# Altium schematic sheet Inverter.SchDoc
size A0; SheetNumber: 2; SheetTotal: 5
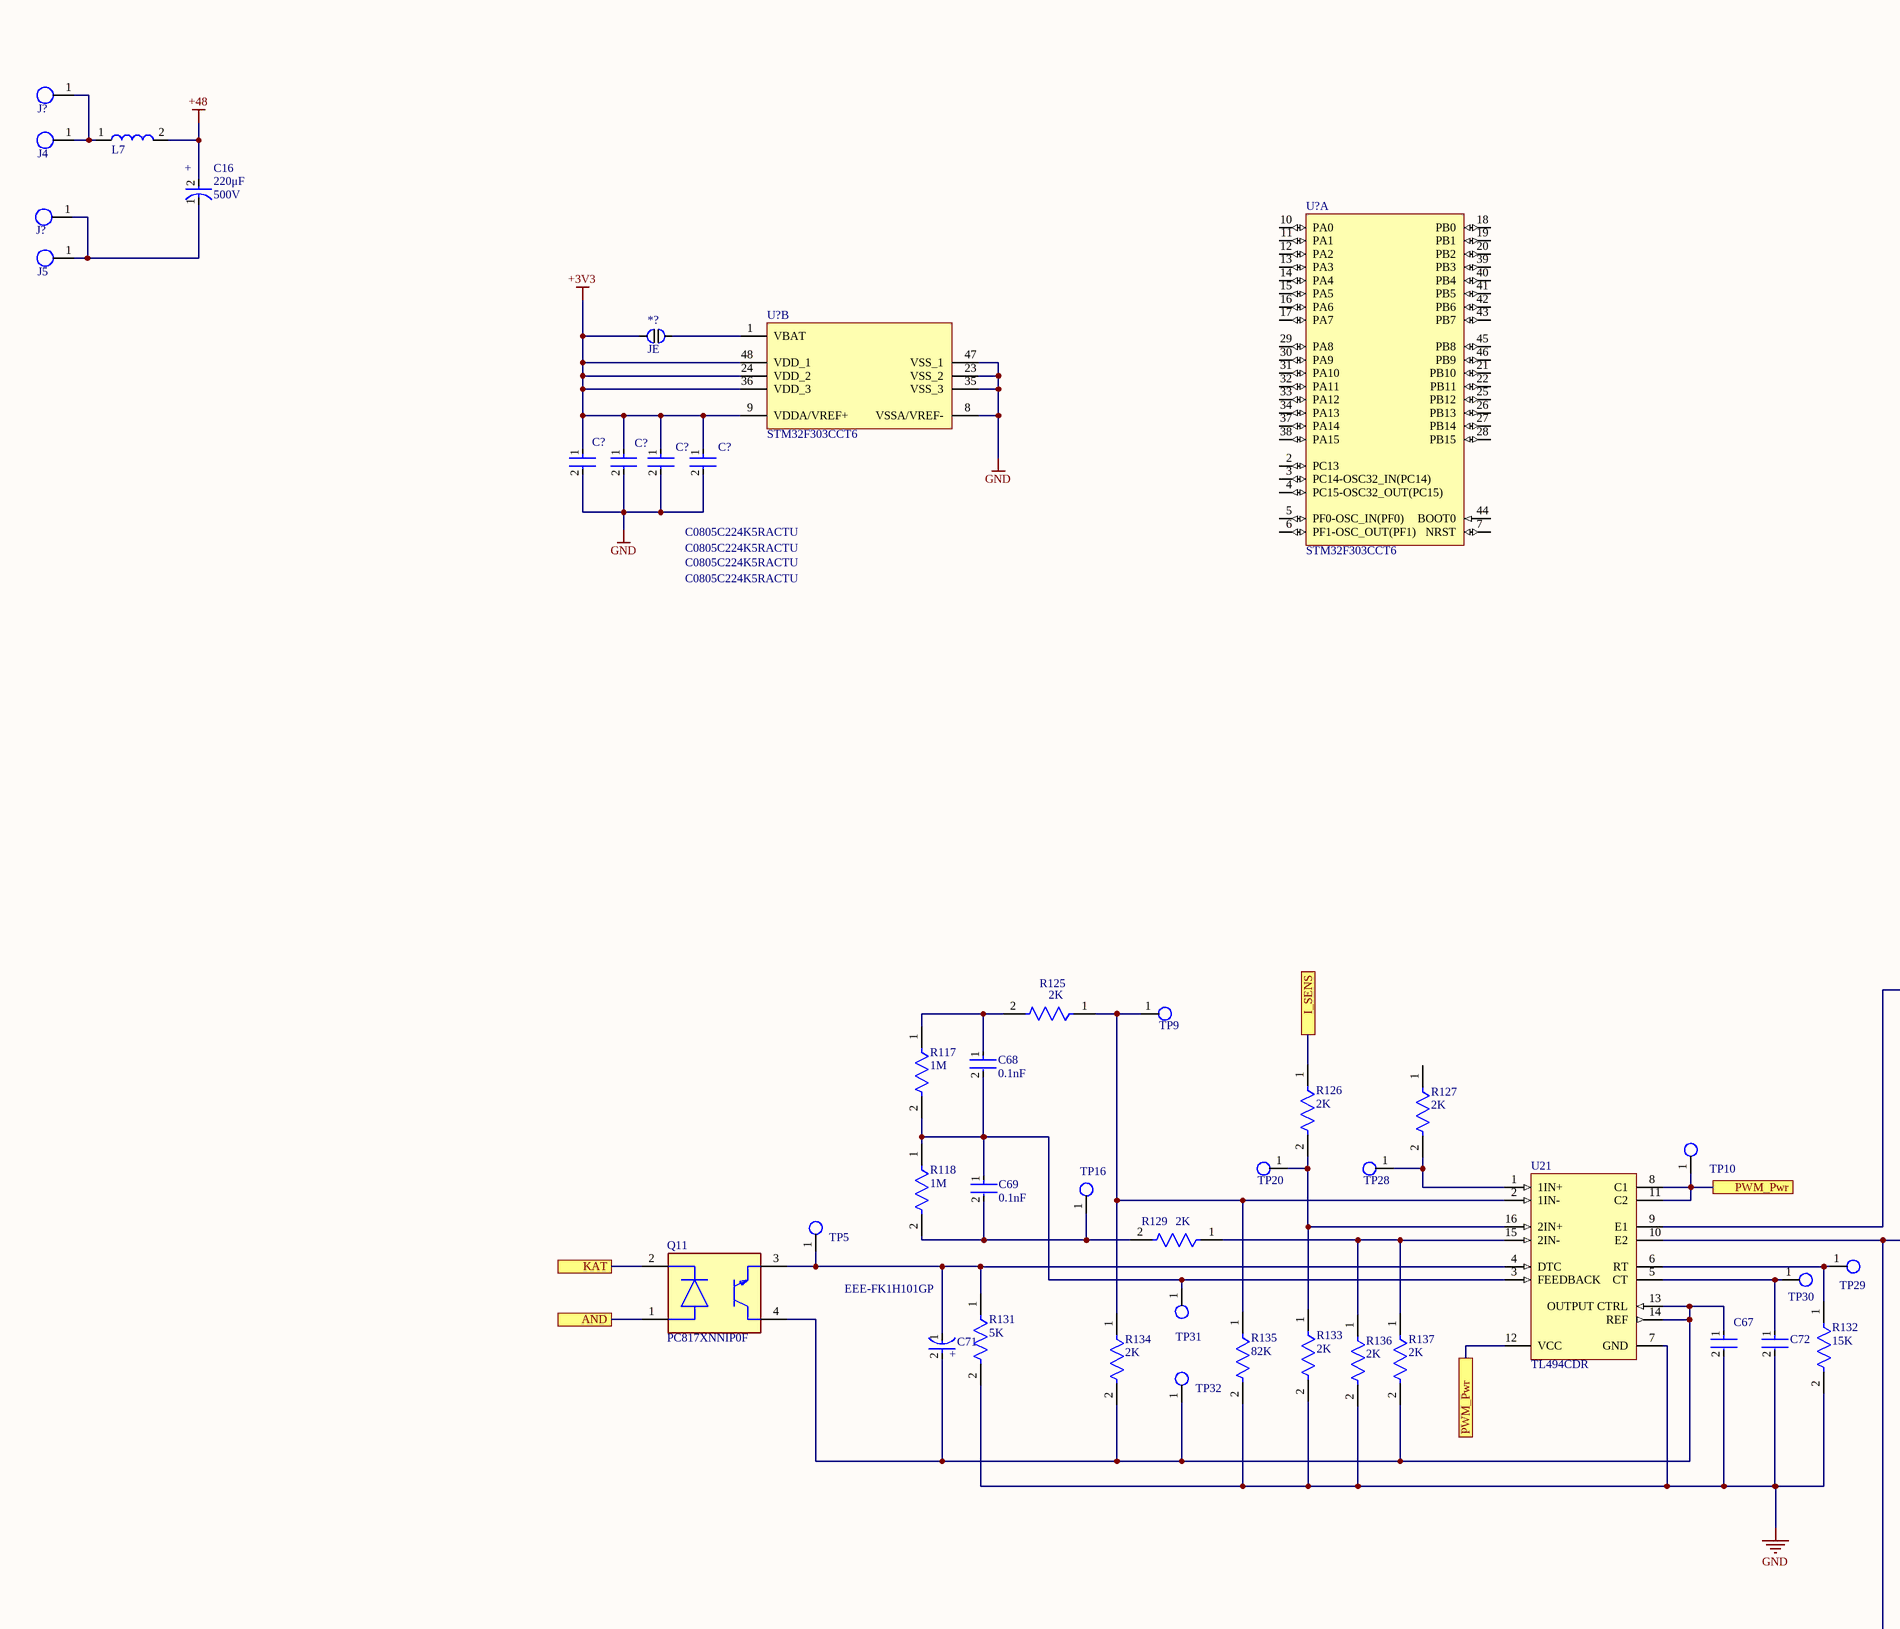
[diagram p0: Inverter.SchDoc, top left]
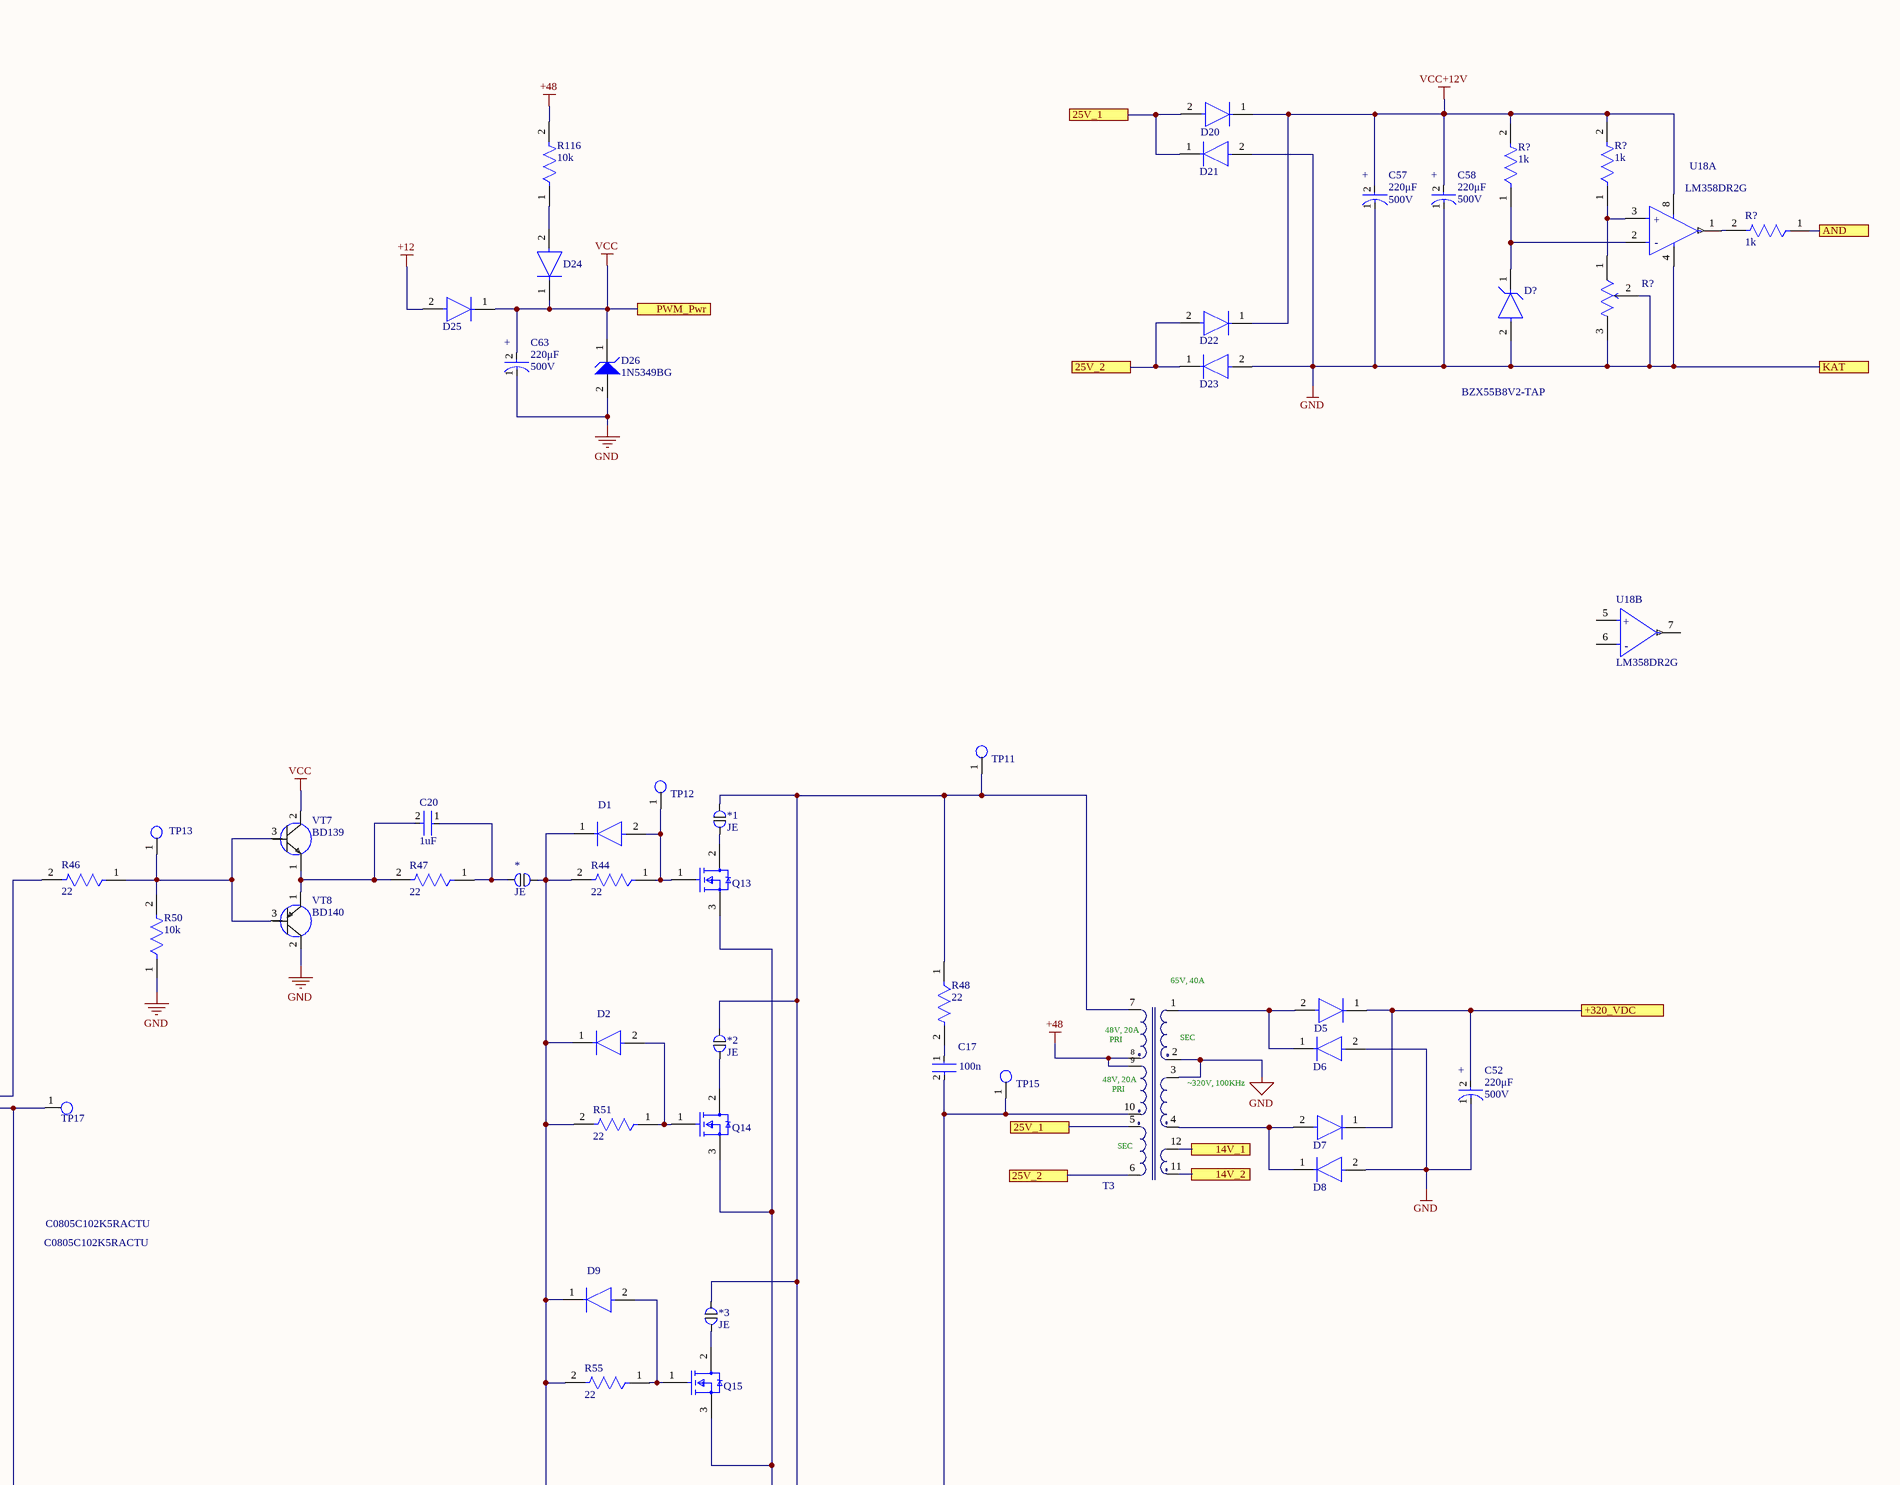
[diagram p1: Inverter.SchDoc, top middle]
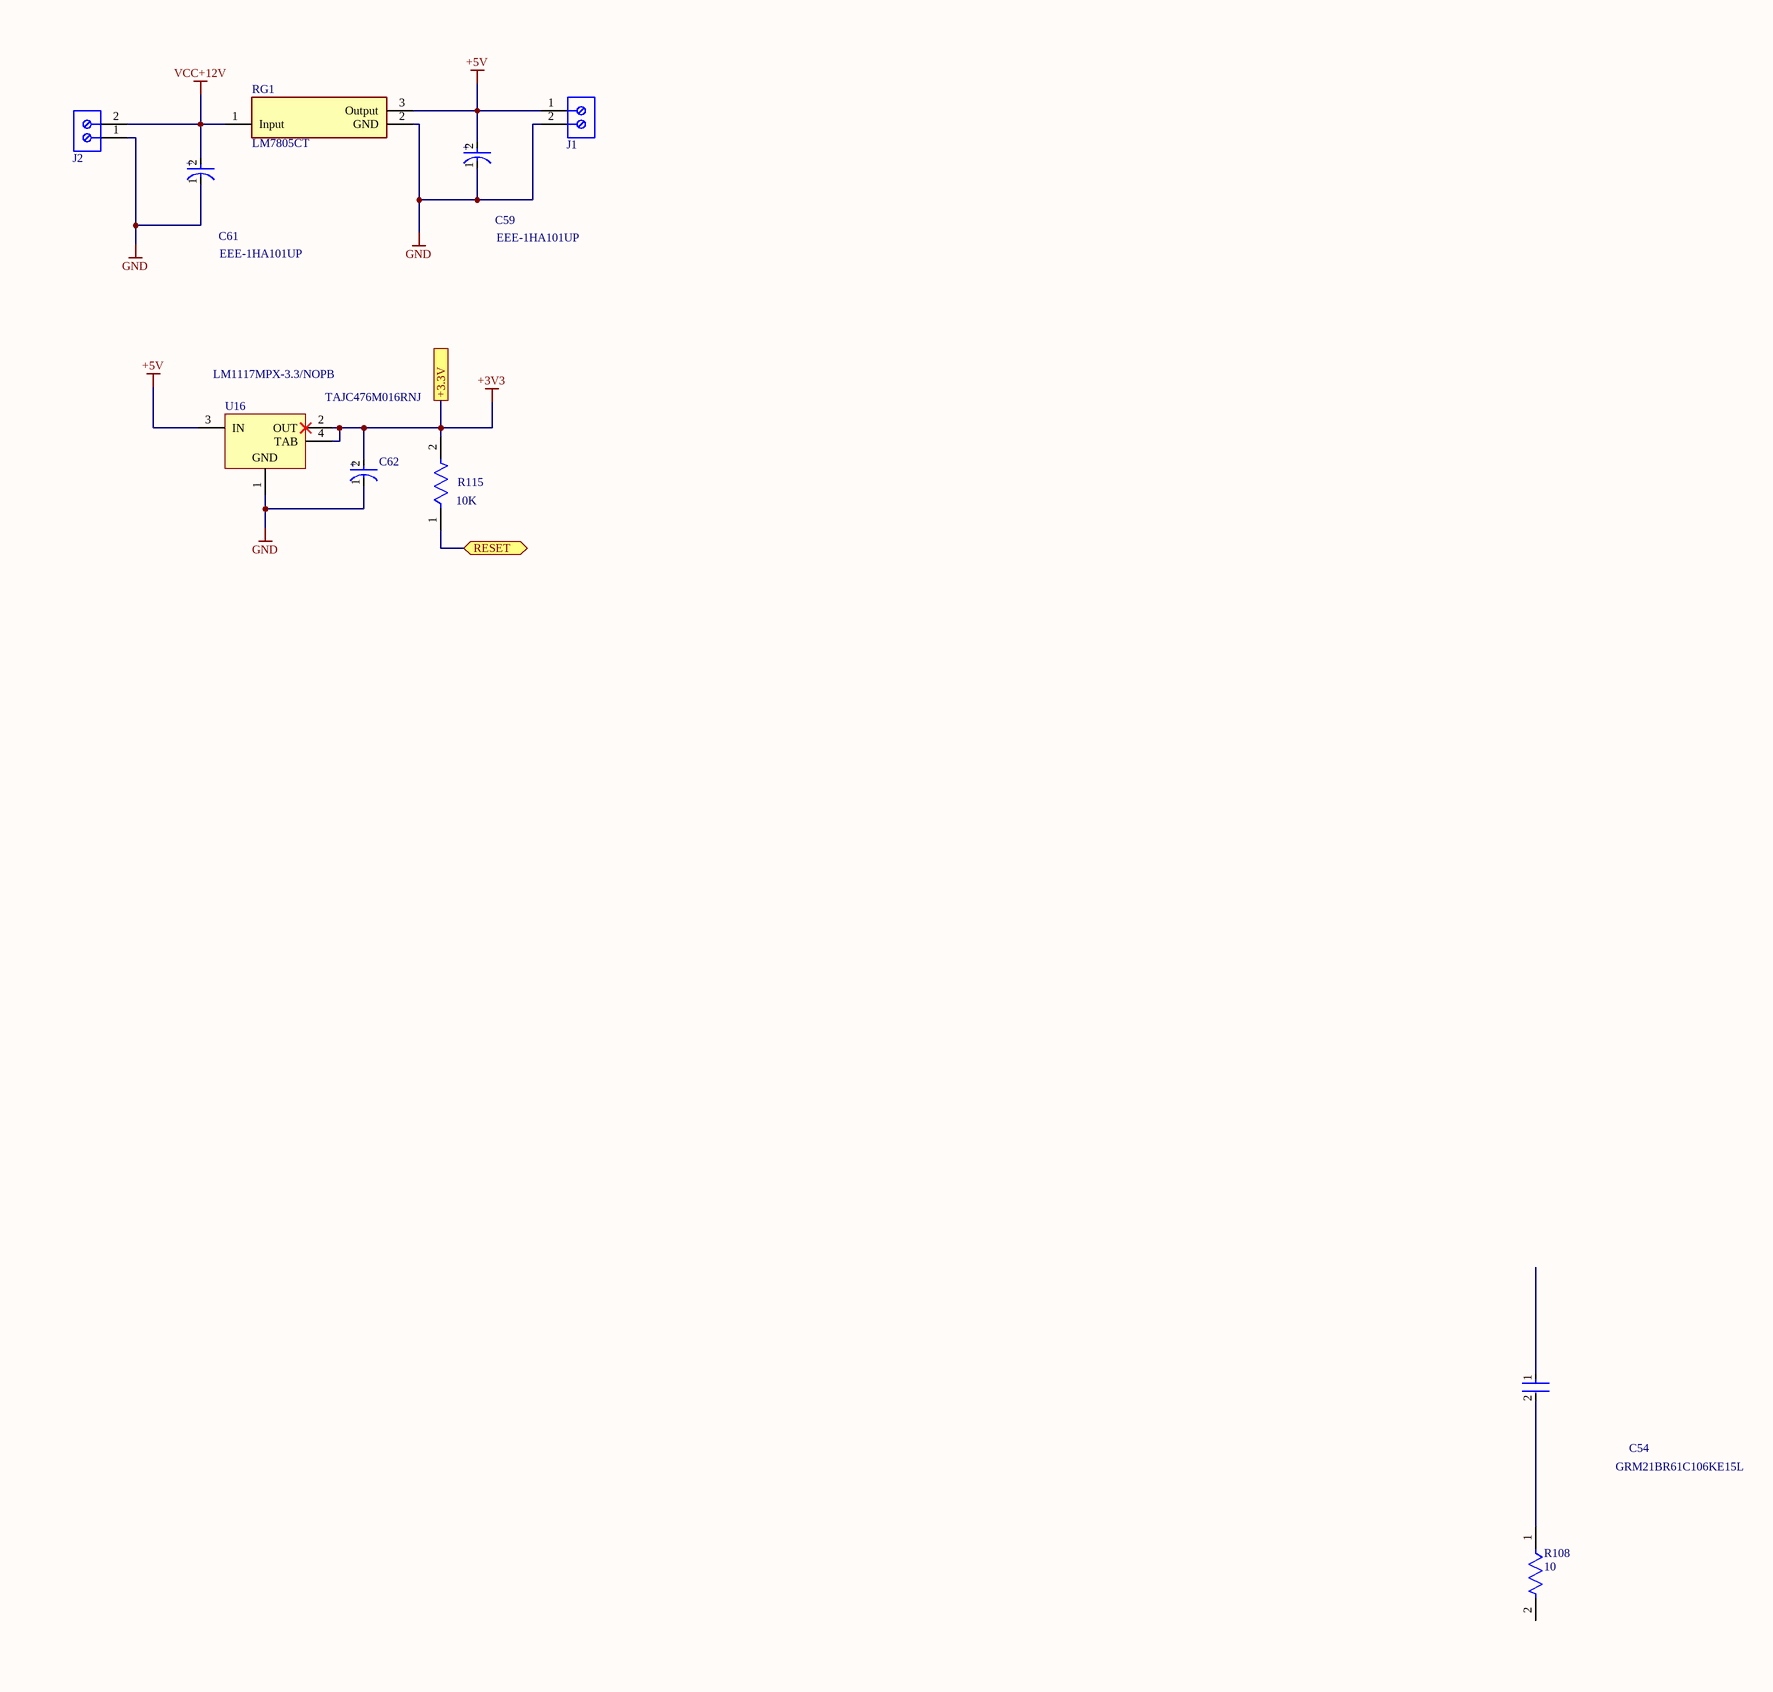
[diagram p2: Inverter.SchDoc, top right]
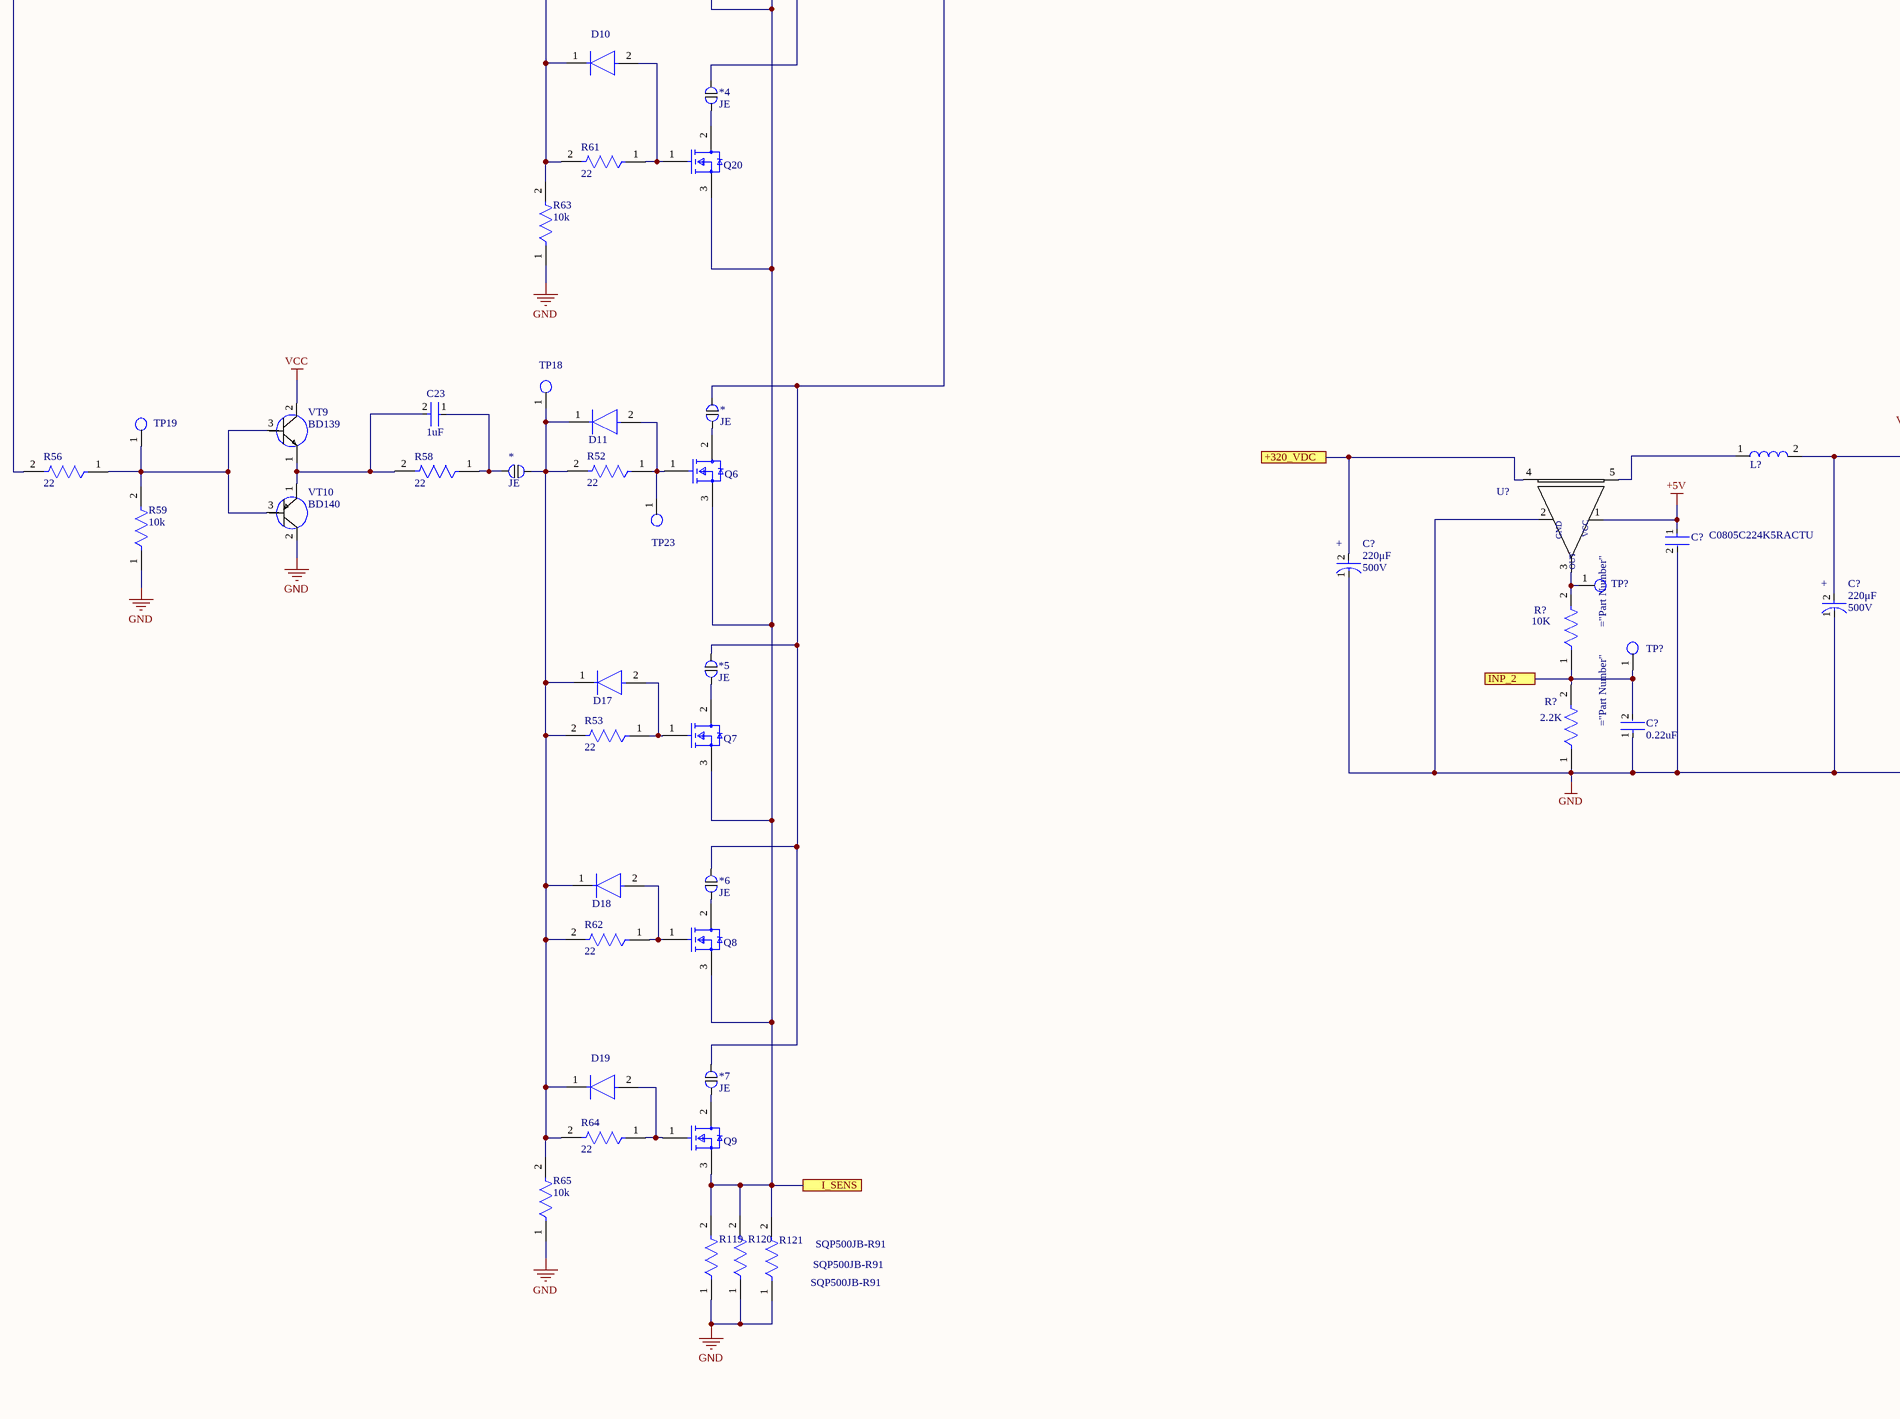
[diagram p3: Inverter.SchDoc, bottom middle]
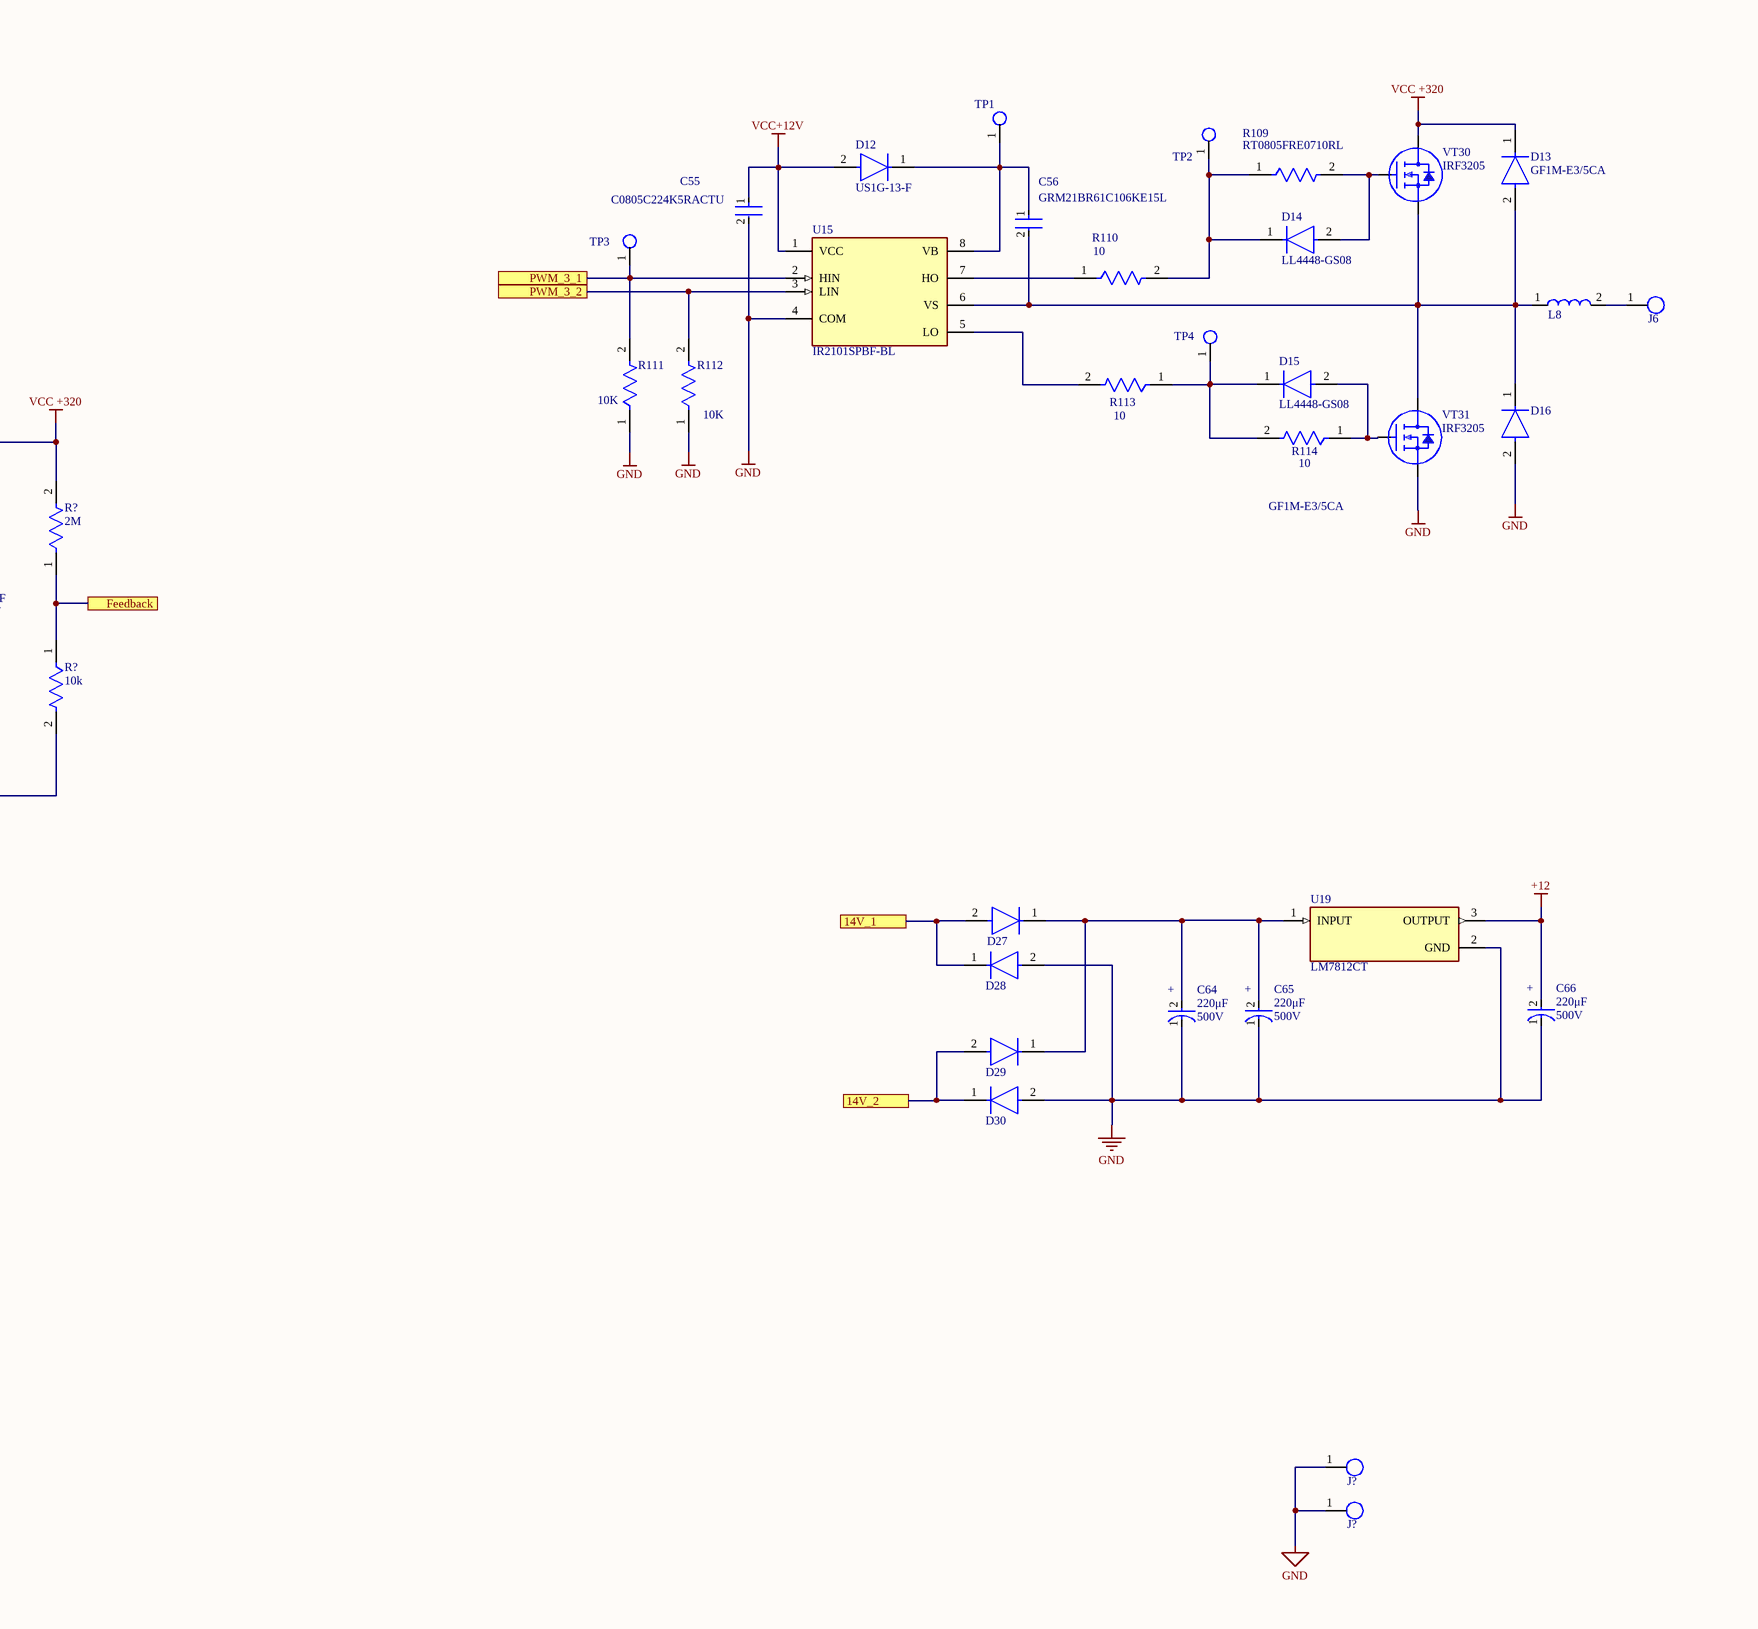
[diagram p4: Inverter.SchDoc, bottom right]

## Parts
(Parts that share a designator on the sheet are numbered #1, #2 ... from top to bottom, then left to right.)
*1  JE  [JE]
*2  JE  [JE]
*3  JE  [JE]
*4  JE  [JE]
*5  JE  [JE]
*6  JE  [JE]
*7  JE  [JE]
*#1  JE  [JE]
*#2  JE  [JE]
*#3  JE  [JE]
*?  JE  [JE]
C16  Capacitance: 220μF  Voltage: 500V  [CAP 330uF 450V]  (hidden comment: Cap_Vishay_MAL219390101E3_eec)
C17  100n  [KEMET_C0805C-DN_IPC_C]
C20  1uF  [KEMET_C0805C-DN_IPC_C]
C23  1uF  [KEMET_C0805C-DN_IPC_C]
C52  Capacitance: 220μF  Voltage: 500V  [CAP 330uF 450V]  (hidden comment: Cap_Vishay_MAL219390101E3_eec)
C54  GRM21BR61C106KE15L  [FP-GRM21B-0_1-IPC_C]
C55  C0805C224K5RACTU  [FP-C0805C-DN-MFG]
C56  GRM21BR61C106KE15L  [FP-GRM21B-0_1-IPC_C]
C57  Capacitance: 220μF  Voltage: 500V  [CAP 330uF 450V]  (hidden comment: Cap_Vishay_MAL219390101E3_eec)
C58  Capacitance: 220μF  Voltage: 500V  [CAP 330uF 450V]  (hidden comment: Cap_Vishay_MAL219390101E3_eec)
C59  EEE-1HA101UP  [FP-SF-MFG]
C61  EEE-1HA101UP  [FP-SF-MFG]
C62  TAJC476M016RNJ  [FP-TAJC-MFG]
C63  Capacitance: 220μF  Voltage: 500V  [CAP 330uF 450V]  (hidden comment: Cap_Vishay_MAL219390101E3_eec)
C64  Capacitance: 220μF  Voltage: 500V  [CAP 330uF 450V]  (hidden comment: Cap_Vishay_MAL219390101E3_eec)
C65  Capacitance: 220μF  Voltage: 500V  [CAP 330uF 450V]  (hidden comment: Cap_Vishay_MAL219390101E3_eec)
C66  Capacitance: 220μF  Voltage: 500V  [CAP 330uF 450V]  (hidden comment: Cap_Vishay_MAL219390101E3_eec)
C67  C0805C102K5RACTU  [FP-C0805C-DN-MFG]
C68  0.1nF  [FP-C0805C-DN-MFG]
C69  0.1nF  [FP-C0805C-DN-MFG]
C71  EEE-FK1H101GP  [FP-FKF-MFG]
C72  C0805C102K5RACTU  [FP-C0805C-DN-MFG]
C?#1  C0805C224K5RACTU  [FP-C0805C-DN-IPC_A]
C?#2  C0805C224K5RACTU  [FP-C0805C-DN-IPC_A]
C?#3  C0805C224K5RACTU  [FP-C0805C-DN-IPC_A]
C?#4  C0805C224K5RACTU  [FP-C0805C-DN-IPC_A]
C?#5  C0805C224K5RACTU  [FP-C0805C-DN-MFG]
C?#6  Capacitance: 220μF  Voltage: 500V  [CAP 330uF 450V]  (hidden comment: Cap_Vishay_MAL219390101E3_eec)
C?#7  Capacitance: 220μF  Voltage: 500V  [CAP 330uF 450V]  (hidden comment: Cap_Vishay_MAL219390101E3_eec)
C?#8  0.22uF  [FP-C0805C-DN-MFG]
D1  Diode_Fairchild-ON_Semiconductor_LL4148_eec  [Fairchild-ON_Semiconductor_LL4148_0]  (value not drawn)
D2  Diode_Fairchild-ON_Semiconductor_LL4148_eec  [Fairchild-ON_Semiconductor_LL4148_0]  (value not drawn)
D5  Diode_Fairchild-ON_Semiconductor_LL4148_eec  [TO-247-2]  (value not drawn)
D6  Diode_Fairchild-ON_Semiconductor_LL4148_eec  [TO-247-2]  (value not drawn)
D7  Diode_Fairchild-ON_Semiconductor_LL4148_eec  [TO-247-2]  (value not drawn)
D8  Diode_Fairchild-ON_Semiconductor_LL4148_eec  [TO-247-2]  (value not drawn)
D9  Diode_Fairchild-ON_Semiconductor_LL4148_eec  [Fairchild-ON_Semiconductor_LL4148_0]  (value not drawn)
D10  Diode_Fairchild-ON_Semiconductor_LL4148_eec  [Fairchild-ON_Semiconductor_LL4148_0]  (value not drawn)
D11  Diode_Fairchild-ON_Semiconductor_LL4148_eec  [Fairchild-ON_Semiconductor_LL4148_0]  (value not drawn)
D12  US1G-13-F  [FP-SMA-MFG]
D13  GF1M-E3/5CA  [FP-GF1M-E3-5CA-MFG]
D14  LL4448-GS08  [FP-6_560-5005_01-4-MFG]
D15  LL4448-GS08  [FP-6_560-5005_01-4-MFG]
D16  GF1M-E3/5CA  [FP-GF1M-E3-5CA-MFG]
D17  Diode_Fairchild-ON_Semiconductor_LL4148_eec  [Fairchild-ON_Semiconductor_LL4148_0]  (value not drawn)
D18  Diode_Fairchild-ON_Semiconductor_LL4148_eec  [Fairchild-ON_Semiconductor_LL4148_0]  (value not drawn)
D19  Diode_Fairchild-ON_Semiconductor_LL4148_eec  [Fairchild-ON_Semiconductor_LL4148_0]  (value not drawn)
D20  Diode_Fairchild-ON_Semiconductor_LL4148_eec  [TO-247-2]  (value not drawn)
D21  Diode_Fairchild-ON_Semiconductor_LL4148_eec  [TO-247-2]  (value not drawn)
D22  Diode_Fairchild-ON_Semiconductor_LL4148_eec  [TO-247-2]  (value not drawn)
D23  Diode_Fairchild-ON_Semiconductor_LL4148_eec  [TO-247-2]  (value not drawn)
D24  Diode_Fairchild-ON_Semiconductor_LL4148_eec  [Fairchild-ON_Semiconductor_LL4148_0]  (value not drawn)
D25  Diode_Fairchild-ON_Semiconductor_LL4148_eec  [Fairchild-ON_Semiconductor_LL4148_0]  (value not drawn)
D26  1N5349BG  [ONSC-SURMETIC40-2-017AA-01]
D27  Diode_Fairchild-ON_Semiconductor_LL4148_eec  [TO-247-2]  (value not drawn)
D28  Diode_Fairchild-ON_Semiconductor_LL4148_eec  [TO-247-2]  (value not drawn)
D29  Diode_Fairchild-ON_Semiconductor_LL4148_eec  [TO-247-2]  (value not drawn)
D30  Diode_Fairchild-ON_Semiconductor_LL4148_eec  [TO-247-2]  (value not drawn)
D?  BZX55B8V2-TAP  [FP-SB-V-3906_04-031_4-MFG]
J1  691101710002  [691101710002]  (value not drawn)
J2  691101710002  [691101710002]  (value not drawn)
J4  KLS8-M3  [KLS8-M3]  (value not drawn)
J5  KLS8-M3  [KLS8-M3]  (value not drawn)
J6  KLS8-M3  [KLS8-M3]  (value not drawn)
J?#1  KLS8-M3  [KLS8-M3]  (value not drawn)
J?#2  KLS8-M3  [KLS8-M3]  (value not drawn)
J?#3  KLS8-M3  [KLS8-M3]  (value not drawn)
J?#4  KLS8-M3  [KLS8-M3]  (value not drawn)
L7  Coil  [Coil_drosel]  (value not drawn)
L8  Coil  [Coil_drosel]  (value not drawn)
L?  Coil  [Coil_drosel]  (value not drawn)
Q6  IRF740PBF  [MOSFET_BEND_rad]  (value not drawn)
Q7  IRF740PBF  [MOSFET_BEND_rad]  (value not drawn)
Q8  IRF740PBF  [MOSFET_BEND_rad]  (value not drawn)
Q9  IRF740PBF  [MOSFET_BEND_rad]  (value not drawn)
Q11  PC817XNNIP0F  [FP-PC817XNNIP0F-MFG]
Q13  IRF740PBF  [Vishay_X15-0364_MFG]  (value not drawn)
Q14  IRF740PBF  [Vishay_X15-0364_MFG]  (value not drawn)
Q15  IRF740PBF  [Vishay_X15-0364_MFG]  (value not drawn)
Q20  IRF740PBF  [Vishay_X15-0364_MFG]  (value not drawn)
R44  22  [Vishay_CRCW0805-e3_IPC_A]
R46  22  [Vishay_CRCW0805-e3_IPC_A]
R47  22  [Vishay_CRCW0805-e3_IPC_A]
R48  22  [Vishay_CRCW0805-e3_IPC_A]
R50  10k  [Vishay_CRCW0805-e3_IPC_A]
R51  22  [Vishay_CRCW0805-e3_IPC_A]
R52  22  [Vishay_CRCW0805-e3_IPC_A]
R53  22  [Vishay_CRCW0805-e3_IPC_A]
R55  22  [Vishay_CRCW0805-e3_IPC_A]
R56  22  [Vishay_CRCW0805-e3_IPC_A]
R58  22  [Vishay_CRCW0805-e3_IPC_A]
R59  10k  [Vishay_CRCW0805-e3_IPC_A]
R61  22  [Vishay_CRCW0805-e3_IPC_A]
R62  22  [Vishay_CRCW0805-e3_IPC_A]
R63  10k  [Vishay_CRCW0805-e3_IPC_A]
R64  22  [Vishay_CRCW0805-e3_IPC_A]
R65  10k  [Vishay_CRCW0805-e3_IPC_A]
R108  10  [FP-CRCW0805-e3-IPC_B]
R109  RT0805FRE0710RL  [FP-RT0805-IPC_C]
R110  10  [FP-RT0805-MFG]
R111  10K  [FP-CRCW0805-e3-IPC_A]
R112  10K  [FP-CRCW0805-e3-IPC_A]
R113  10  [Vishay_CRCW0805-e3_IPC_A]
R114  10  [FP-CRCW0805-e3-IPC_B]
R115  10K  [Vishay_CRCW0805-e3_IPC_A]
R116  10k  [Vishay_CRCW0805-e3_IPC_A]
R117  1M  [FP-CRCW0805-e3-MFG]
R118  1M  [FP-CRCW0805-e3-MFG]
R119  SQP500JB-R91  [FP-SQP500-MFG]
R120  SQP500JB-R91  [FP-SQP500-MFG]
R121  SQP500JB-R91  [FP-SQP500-MFG]
R125  2K  [FP-CRCW0805-e3-MFG]
R126  2K  [FP-CRCW0805-e3-MFG]
R127  2K  [FP-CRCW0805-e3-MFG]
R129  2K  [FP-CRCW0805-e3-MFG]
R131  5K  [FP-CRCW0805-e3-MFG]
R132  15K  [FP-CRCW0805-e3-MFG]
R133  2K  [FP-CRCW0805-e3-MFG]
R134  2K  [FP-CRCW0805-e3-MFG]
R135  82K  [FP-CRCW0805-e3-MFG]
R136  2K  [FP-CRCW0805-e3-MFG]
R137  2K  [FP-CRCW0805-e3-MFG]
R?#1  1k  [Vishay_CRCW0805-e3_IPC_A]
R?#2  1k  [Vishay_CRCW0805-e3_IPC_A]
R?#3  1k  [Vishay_CRCW0805-e3_IPC_A]
R?#4  3296W-1-202LF  [Bourns_3296W_MFG]  (value not drawn)
R?#5  2M  [Vishay_CRCW0805-e3_IPC_A]
R?#6  10K  [Vishay_CRCW0805-e3_IPC_A]
R?#7  10k  [Vishay_CRCW0805-e3_IPC_A]
R?#8  2.2K  [Vishay_CRCW0805-e3_IPC_A]
RG1  Part Number: LM7805CT  [TO-220(bend_rad)]  (hidden comment: Reg_Fairchild_LM7805CT_eec)
T3  ETD59  [ETD-59_3F]  (value not drawn)
TP1  Test_Point_PCB  [Test_Point]  (value not drawn)
TP2  Test_Point_PCB  [Test_Point]  (value not drawn)
TP3  Test_Point_PCB  [Test_Point]  (value not drawn)
TP4  Test_Point_PCB  [Test_Point]  (value not drawn)
TP5  Test_Point_PCB  [Test_Point]  (value not drawn)
TP9  Test_Point_PCB  [Test_Point]  (value not drawn)
TP10  Test_Point_PCB  [Test_Point]  (value not drawn)
TP11  Test_Point_PCB  [Test_Point]  (value not drawn)
TP12  Test_Point_PCB  [Test_Point]  (value not drawn)
TP13  Test_Point_PCB  [Test_Point]  (value not drawn)
TP15  Test_Point_PCB  [Test_Point]  (value not drawn)
TP16  Test_Point_PCB  [Test_Point]  (value not drawn)
TP17  Test_Point_PCB  [Test_Point]  (value not drawn)
TP18  Test_Point_PCB  [Test_Point]  (value not drawn)
TP19  Test_Point_PCB  [Test_Point]  (value not drawn)
TP20  Test_Point_PCB  [Test_Point]  (value not drawn)
TP23  Test_Point_PCB  [Test_Point]  (value not drawn)
TP28  Test_Point_PCB  [Test_Point]  (value not drawn)
TP29  Test_Point_PCB  [Test_Point]  (value not drawn)
TP30  Test_Point_PCB  [Test_Point]  (value not drawn)
TP31  Test_Point_PCB  [Test_Point]  (value not drawn)
TP32  Test_Point_PCB  [Test_Point]  (value not drawn)
TP?#1  Test_Point_PCB  [Test_Point]  (value not drawn)
TP?#2  Test_Point_PCB  [Test_Point]  (value not drawn)
U15  IR2101SPBF-BL  [FP-PG-DSO-8-IPC_B]
U16  LM1117MPX-3.3/NOPB  [DCY0004A_L]
U18  LM358DR2G  [FP-751-07-IPC_C]  (parts A,B of 2)
U19  LM7812CT  [FP-TO220B03-MFG]
U21  TL494CDR  [D0016A_N]
U?#1  STM32F303CCT6  [STM-LQFP48_M]  (part A of 2)
U?#2  STM32F303CCT6  [STM-LQFP48_M]  (part B of 2)
U?#3  ACS758  [ACS758-100]  (value not drawn)
VT7  BD139  [BD139_TO-126_BEND]
VT8  BD140  [BD140_TO-126_BEND]
VT9  BD139  [BD139_TO-126_BEND]
VT10  BD140  [BD140_TO-126_BEND]
VT30  IRF3205  [TO-220(bend2)]
VT31  IRF3205  [TO-220(bend2)]

## Ports
14V_1, 14V_2, 25V_1, 25V_2, +3.3V, +320_VDC, AND, Feedback, I_SENS, INP_2, KAT, PWM_3_1, PWM_3_2, PWM_Pwr, RESET (bidir)

## Nets
+3V3: *?.1 C62.2(A) C?#1.1 C?#2.1 C?#3.1 C?#4.1 R115.2 U16.2(OUT) U16.4(TAB) U?#2.9(VDDA/VREF+) U?#2.24(VDD_2) U?#2.36(VDD_3) U?#2.48(VDD_1) ; port +3.3V
+5V: C59.2(A) C?#5.1 J1.1 RG1.3(Output) U16.3(IN) U?#3.1(+VCC)
+12: C66.2(A) D25.2(A) U19.3(OUTPUT)
+48: C16.2(A) L7.2 R116.2 T3.8 T3.9
GND: C52.1(C) C55.2 C57.1(C) C58.1(C) C59.1(C) C61.1(C) C62.1(C) C63.1(C) C64.1(C) C65.1(C) C66.1(C) C67.2 C72.2 C?#1.2 C?#2.2 C?#3.2 C?#4.2 C?#5.2 C?#6.1(C) C?#7.1(C) C?#8.1 D6.2(A) D8.2(A) D16.2(A) D21.2(A) D23.2(A) D26.2(A) D28.2(A) D30.2(A) D?.2(A) J1.2 J2.1 J?#3.1 J?#4.1 Q11.2(C) R50.1 R59.1 R63.1 R65.1 R111.1 R112.1 R119.1 R120.1 R121.1 R131.2 R132.2 R133.2 R135.2 R136.2 R?#4.2(WIPER) R?#4.3(CW) R?#7.2 R?#8.1 RG1.2(GND) T3.2 T3.3 U15.4(COM) U16.1(GND) U18.4(VEE/GND) U19.2(GND) U21.7(GND) U?#2.8(VSSA/VREF-) U?#2.23(VSS_2) U?#2.35(VSS_3) U?#2.47(VSS_1) U?#3.2(GND) VT8.2(C) VT10.2(C) VT31.S ; port KAT
VCC: C63.2(A) D24.1(C) D25.1(C) D26.1(K) TP10.1(G9) U21.8(C1) U21.11(C2) U21.12(VCC) VT7.2(C) VT9.2(C) ; port PWM_Pwr
VCC +320: C?#7.2(A) D13.1(C) L?.2 R?#5.2 VT30.D
VCC+12V: C55.1 C57.2(A) C58.2(A) C61.2(A) D12.2(A) D20.1(C) D22.1(C) J2.2 R?#1.2 R?#2.2 RG1.1(Input) U15.1(VCC) U18.8(VCC)
14V_1: D27.2(A) D28.1(C) T3.12 ; port 14V_1
14V_2: D29.2(A) D30.1(C) T3.11 ; port 14V_2
25V_1: D20.2(A) D21.1(C) T3.5 ; port 25V_1
25V_2: D22.2(A) D23.1(C) T3.6 ; port 25V_2
+320_VDC: C52.2(A) C?#6.2(A) D5.1(C) D7.1(C) U?#3.4(+IP) ; port +320_VDC
AND: Q11.1(A) R?#3.1 ; port AND
Feedback: R?#5.1 R?#7.1 ; port Feedback
I_SENS: Q6.3(S) Q7.3(S) Q8.3(S) Q9.3(S) Q13.3(S) Q14.3(S) Q15.3(S) Q20.3(S) R119.2 R120.2 R121.2 R126.1 ; port I_SENS
INP_2: C?#8.2 R?#6.1 R?#8.2 TP?#2.1(G9) ; port INP_2
PWM_3_1: R111.2 TP3.1(G9) U15.2(HIN) ; port PWM_3_1
PWM_3_2: R112.2 U15.3(LIN) ; port PWM_3_2
RESET: R115.1 ; port RESET
Net*1_1: *1.1 *2.1 *3.1 *4.1 R48.1 T3.7 TP11.1(G9)
Net*1_2: *1.2 Q13.2(D)
Net*2_2: *2.2 Q14.2(D)
Net*3_2: *3.2 Q15.2(D)
Net*4_2: *4.2 Q20.2(D)
Net*5_1: *5.1 *6.1 *7.1 *#2.1 C17.2 T3.10 TP15.1(G9)
Net*5_2: *5.2 Q7.2(D)
Net*6_2: *6.2 Q8.2(D)
Net*7_2: *7.2 Q9.2(D)
Net*#1_1: *#1.1 D1.1(C) D2.1(C) D9.1(C) D10.1(C) R44.2 R51.2 R55.2 R61.2 R63.2
Net*#1_2: *#1.2 C20.1 R47.1
Net*#2_2: *#2.2 Q6.2(D)
Net*#3_1: *#3.1 D11.1(C) D17.1(C) D18.1(C) D19.1(C) R52.2 R53.2 R62.2 R64.2 R65.2 TP18.1(G9)
Net*#3_2: *#3.2 C23.1 R58.1
Net*?_2: *?.2 U?#2.1(VBAT)
NetC16_1: C16.1(C) J5.1 J?#2.1
NetC17_1: C17.1 R48.2
NetC20_2: C20.2 R47.2 VT7.1(E) VT8.1(E)
NetC23_2: C23.2 R58.2 VT9.1(E) VT10.1(E)
NetC54_2: C54.2 R108.1
NetC56_1: C56.1 D12.1(C) TP1.1(G9) U15.8(VB)
NetC56_2: C56.2 D13.2(A) D16.1(C) L8.1 U15.6(VS) VT30.S VT31.D
NetC64_2: C64.2(A) C65.2(A) D27.1(C) D29.1(C) U19.1(INPUT)
NetC67_1: C67.1 C71.2(A) Q11.4(C) R134.2 R137.2 TP32.1(G9) U21.13(OUTPUT_CTRL) U21.14(REF)
NetC68_1: C68.1 R117.1 R125.2
NetC68_2: C68.2 C69.1 R117.2 R118.1 TP31.1(G9) U21.3(FEEDBACK)
NetC69_2: C69.2 R118.2 R129.2 TP16.1(G9)
NetC71_1: C71.1(C) Q11.3(E) R131.1 TP5.1(G9) U21.4(DTC)
NetC72_1: C72.1 TP30.1(G9) U21.5(CT)
NetD1_2: D1.2(A) Q13.1(G) R44.1 TP12.1(G9)
NetD2_2: D2.2(A) Q14.1(G) R51.1
NetD5_2: D5.2(A) D6.1(C) T3.1
NetD7_2: D7.2(A) D8.1(C) T3.4
NetD9_2: D9.2(A) Q15.1(G) R55.1
NetD10_2: D10.2(A) Q20.1(G) R61.1
NetD11_2: D11.2(A) Q6.1(G) R52.1 TP23.1(G9)
NetD14_1: D14.1(C) R109.1 R110.2 TP2.1(G9)
NetD14_2: D14.2(A) R109.2 VT30.G
NetD15_1: D15.1(C) R113.1 R114.2 TP4.1(G9)
NetD15_2: D15.2(A) R114.1 VT31.G
NetD17_2: D17.2(A) Q7.1(G) R53.1
NetD18_2: D18.2(A) Q8.1(G) R62.1
NetD19_2: D19.2(A) Q9.1(G) R64.1
NetD24_2: D24.2(A) R116.1
NetD?_1: D?.1(C) R?#2.1 U18.2(INPUT_A-)
NetJ4_1: J4.1 J?#1.1 L7.1
NetJ6_1: J6.1 L8.2
NetL?_1: L?.1 U?#3.5(-IP)
NetR46_1: R46.1 R50.2 TP13.1(G9) VT7.3(B) VT8.3(B)
NetR46_2: R46.2 U21.9(E1)
NetR56_1: R56.1 R59.2 TP19.1(G9) VT9.3(B) VT10.3(B)
NetR56_2: R56.2 TP17.1(G9) U21.10(E2)
NetR110_1: R110.1 U15.7(HO)
NetR113_2: R113.2 U15.5(LO)
NetR125_1: R125.1 R134.1 R135.1 TP9.1(G9) U21.2(1IN-)
NetR126_2: R126.2 R133.1 TP20.1(G9) U21.16(2IN+)
NetR127_2: R127.2 TP28.1(G9) U21.1(1IN+)
NetR129_1: R129.1 R136.1 R137.1 U21.15(2IN-)
NetR132_1: R132.1 TP29.1(G9) U21.6(RT)
NetR?#1_1: R?#1.1 R?#4.1(CCW) U18.3(INPUT_A+)
NetR?#3_2: R?#3.2 U18.1(OUTPUT_A)
NetR?#6_2: R?#6.2 TP?#1.1(G9) U?#3.3(OUT)

Not connected (* = marked no-connect by the designer): C54 1; R108 2; R127 1; U18 5(INPUT_B+) 6(INPUT_B-) 7(OUTPUT_B); U?#1 2(PC13) 3(PC14-OSC32_IN(PC14)) 4(PC15-OSC32_OUT(PC15)) 5(PF0-OSC_IN(PF0)) 6(PF1-OSC_OUT(PF1)) 7(NRST) 10(PA0) 11(PA1) 12(PA2) 13(PA3) 14(PA4) 15(PA5) 16(PA6) 17(PA7) 18(PB0) 19(PB1) 20(PB2) 21(PB10) 22(PB11) 25(PB12) 26(PB13) 27(PB14) 28(PB15) 29(PA8) 30(PA9) 31(PA10) 32(PA11) 33(PA12) 34(PA13) 37(PA14) 38(PA15) 39(PB3) 40(PB4) 41(PB5) 42(PB6) 43(PB7) 44(BOOT0) 45(PB8) 46(PB9)

## Notes on the sheet
- (in symbol ACS758) VCC
- (in symbol Cap_Vishay_MAL219390101E3_eec) +
- (in symbol CMP-1310-00291-2, part A) +; -
- (in symbol CMP-1310-00291-2, part B) +; -
- (in symbol CMP-04424-000193-1) +
- (in symbol CMP-05427-000015-1) +
- (in symbol CMP-05427-000032-1) +
- (in symbol Transformer 48x410V) 65V, 40A; 48V, 20A; PRI; SEC; ~320V, 100KHz

## Library data of the parts
C16 C52 C57 C58 C63-C66 C?#6 C?#7 = Cap_Vishay_MAL219390101E3_eec: CAP 220µF 500V Aluminum Capacitors Radial, Can - Snap-In 900 mOhm 6000 Hrs @ 105°C; Manufacturer: Vishay; Tolerance: ±20%; Part Number: MAL219390101E3; helpURL: https://upverter.com/upn/revision/6e31225a6b8864ee/; ComponentLink2Description: Datasheet; Temperature: -25°C to +105°C; Package: RADIAL; Supplier 2: Mouser; Price: 7.89477511745; Supplier 1: Digi-Key; ComponentLink1URL: https://upverter.com/upn/revision/6e31225a6b8864ee/; Supplier Part Number 2: 594-MAL219390101E3; Supplier Part Number 1: 4569PHBK-ND; Value: 220μF; ComponentLink1Description: Upverter; ComponentLink2URL: https://upverter.com/datasheet/b964967ce70ad5180ed35a6206109933e2b1bb55.pdf; RoHS: TRUE; Mouser Part Number: 594-MAL219390101E3; Ipc Land Pattern Name: CAPRD1000W120D3500H3000; Temperature Range High: +105°C; Digikey Description: CAP 220µF 500V Aluminum Capacitors Radial, Can - Snap-In 900 mOhm 6000 Hrs @ 105°C; Digikey Part Number: 4569PHBK-ND; Lead Free: yes; Temperature Range Low: -25°C; Mounting Type: Through Hole
C17 = C0805C104J4RACTU
C20 C23 = C0805C104J4RACTU: 100pF
C54 C56 = CMP-2007-03453-2: Chip Multilayer Ceramic Capacitors for General Purpose, 0805, 10uF, X5R, 15%, 10%, 16V; Radiation Hardening: No; Thickness: 0.053inch; Voltage Rating (DC): 16V; Lead Free: Lead Free; Package Quantity: 1; Width: 1.25mm; Case Code (Imperial): 0805; Depth: 1.25mm; Packaging: Tape and Reel; Dielectric: X5R; Max Operating Temperature: 85°C; Tolerance: 10%; Voltage Rating: 16V; Voltage: 16V; Capacitance: 10uF; Height: 1.25mm; Case Code (Metric): 2012; Material: Ceramic; Mount: Surface Mount; Case/Package: 0805; REACH SVHC: No SVHC; Length: 2mm; Min Operating Temperature: -55°C; Termination: SMD/SMT
C55 C?#1-C?#5 = CMP-1036-04552-2: CAP CER 0.22UF 50V X7R 0805; Manufacturer: KEMET; Value: 0.22 μF; Temperature Coefficient: 30ppm/°C; Material: Ceramic; Tolerance: 0.1; ComponentLink2URL: https://content.kemet.com/datasheets/KEM_C1003_C0G_SMD.pdf; Temperature Characteristic: X7R; Device Class L3: Ceramic Capacitors; Lead Free: Yes; Temperature: -55°C to +125°C; RoHS: TRUE; Capacitance: 0.22 μF; Automotive: No; Octopart: https://octopart.com/c0805c224k5ractu-kemet-144670; Manufacturer Part Number: C0805C224K5RACTU; Temperature Range Low: -55°C; Height: 0.88mm; Device Class L1: Passive Components; Digikey Description: CAP CER 0.22UF 50V X7R 0805; ComponentLink2Description: Datasheet; Mouser Description: CAP CER 0.22UF 50V X7R 0805; Category: Cap; Ipc Land Pattern Name: CAPC200125X78; Temperature Range High: +125°C; Package: C0805C-DN; Device Class L2: Capacitors; Voltage Rating: 50 V
C59 C61 = CMP-05427-000015-1: CAP ALUM 100UF 20% 50V SMD; Manufacturer: Panasonic; Automotive Grade: Grade 3; Leakage Current: 100uA; Dissipation Factor: 0.12%; Life: 2000Hours; Ripple Current: 200mA; Material: Aluminum; ComponentLink2Description: Datasheet; Category: Cap; Voltage Rating: 50V; Value: 100uF; Octopart: https://octopart.com/eee-1ha101up-panasonic-55396734; Digikey Description: CAP ALUM 100UF 20% 50V SMD; Package: SF; RoHS: TRUE; Height: 10.5mm; ComponentLink2URL: https://industrial.panasonic.com/cdbs/www-data/pdf/RDE0000/ABA0000C1145.pdf; Tolerance: 20%; Mouser Description: Cap Aluminum Lytic 100uF 50V 20% (8 X 10.2mm) SMD 200mA 2000h 85C Automotive T/R; Device Class L2: Capacitors; Temperature Range High: +85°C; Lead Free: Yes; Device Class L3: Aluminum Electrolytic Capacitors; Device Class L1: Passive Components; Manufacturer Part Number: EEE-1HA101UP; Temperature: -40°C to +85°C; Automotive: Yes; Capacitance: 100uF; Voltage: 50V; Temperature Range Low: -40°C
C62 = CMP-04424-000193-1: 47uF 16V  ±20% 500mΩ 2312  SMD Tantalum Capacitor; Polarity: Polar; ESR (Equivalent Series Resistance): 500mR; Dissipation Factor: 6%; Leakage Current: 7.5uA; RoHS Compliant: Yes; Case/Package: 6032-28; Construction: Flat; Case Code (Imperial): 2312; Package Quantity: 1; Voltage Rating: 16V; Length: 6mm; Height - Seated (Max): 0.11inch; Voltage Rating (DC): 16V; Series: TAJ; Features: General Purpose; Radiation Hardening: No; Case Code (Metric): 6032; Tolerance: 20%; Max Operating Temperature: 125°C; Depth: 3.2mm; REACH SVHC: No SVHC; Capacitance: 47uF; Width: 3.2mm; Height: 2.8mm; Lead Free: Lead Free; Packaging: Tape and Reel; Number of Pins: 2; Min Operating Temperature: -55°C; Mount: Surface Mount; Termination: SMD/SMT
C67 C72 = CMP-2007-01097-2: CAP CER 1000PF 50V X7R 0805; Manufacturer: KEMET; Capacitance: 1,000 pF; Value: 1,000 pF; Tolerance: 0.1; Temperature Coefficient: 30ppm/°C; Material: Ceramic; Temperature Range High: +125°C; Automotive: No; Device Class L3: Ceramic Capacitors; Category: Cap; Height: 0.88mm; Ipc Land Pattern Name: CAPC200125X78; Mouser Description: Cap Ceramic 0.001uF 50V X7R 10% SMD 0805 125C Plastic T/R; Device Class L1: Passive Components; Lead Free: Yes; Temperature Range Low: -55°C; ComponentLink2URL: https://content.kemet.com/datasheets/KEM_C1003_C0G_SMD.pdf; Octopart: https://octopart.com/c0805c102k5ractu-kemet-93010; Temperature: -55°C to +125°C; Package: C0805C-DN; RoHS: TRUE; Voltage Rating: 50 V; ComponentLink2Description: Datasheet; Digikey Description: CAP CER 1000PF 50V X7R 0805; Device Class L2: Capacitors; Manufacturer Part Number: C0805C102K5RACTU; Temperature Characteristic: X7R
C68 C69 = CMP-2007-00254-2: CAP CER 10000PF 50V X7R 0805; Manufacturer Part Number: C0805C103J5RACTU; Manufacturer: KEMET; Value: 10,000 pF; Material: Ceramic; Temperature Coefficient: 30ppm/°C; Tolerance: 0.05; Device Class L1: Passive Components; Temperature: -55°C to +125°C; Lead Free: Yes; ComponentLink2URL: https://content.kemet.com/datasheets/KEM_C1003_C0G_SMD.pdf; Device Class L3: Ceramic Capacitors; Temperature Characteristic: X7R; Temperature Range High: +125°C; Mouser Description: Capacitor; Ceramic; Cap 0.01uF; Tol 5%; Vol-Rtg 50 V; SMT; Case 0805; X7R; TR; ComponentLink2Description: Datasheet; Height: 0.88mm; Digikey Description: CAP CER 10000PF 50V X7R 0805; Capacitance: 10,000 pF; Temperature Range Low: -55°C; Device Class L2: Capacitors; Octopart: https://octopart.com/c0805c103j5ractu-kemet-133473; Voltage Rating: 50 V; Category: Cap; RoHS: TRUE; Automotive: No; Package: C0805C-DN; Ipc Land Pattern Name: CAPC200125X78
C71 = CMP-05427-000032-1: CAP ALUM 100UF 20% 50V SMD; Ripple Current (AC): 350mA; Impedance: 340mR; Life (Hours): 5000Hour; Leakage Current: 10mA; Voltage: 50V; Voltage Rating (DC): 50V; ESR (Equivalent Series Resistance): 340mR; Packaging: Tape and Reel; Radiation Hardening: No; Construction: Cylindrical; Case/Package: SMD/SMT; Contact Plating: Tin; Min Operating Temperature: -55°C; Lead Free: Lead Free; Mount: Surface Mount; Number of Pins: 2; Height: 10.2mm; Tolerance: 20%; Package Quantity: 1; Voltage Rating: 50V; Termination: SMD/SMT; Width: 10mm; Max Operating Temperature: 105°C; Height - Seated (Max): 0.402inch; RoHS Compliant: Yes; Ripple Current: 350mA; Length: 10.2mm; Capacitance: 100uF; Series: FK; REACH SVHC: No SVHC; Diameter: 8mm
C?#8 = CMP-1036-04552-2: CAP CER 0.22UF 50V X7R 0805; Manufacturer: KEMET; Manufacturer Part Number: C0805C224K5RACTU; Value: 0.22 μF; Temperature Coefficient: 30ppm/°C; Material: Ceramic; Tolerance: 0.1; ComponentLink2URL: https://content.kemet.com/datasheets/KEM_C1003_C0G_SMD.pdf; Temperature Characteristic: X7R; Device Class L3: Ceramic Capacitors; Lead Free: Yes; Temperature: -55°C to +125°C; RoHS: TRUE; Capacitance: 0.22 μF; Automotive: No; Octopart: https://octopart.com/c0805c224k5ractu-kemet-144670; Temperature Range Low: -55°C; Height: 0.88mm; Device Class L1: Passive Components; Digikey Description: CAP CER 0.22UF 50V X7R 0805; ComponentLink2Description: Datasheet; Mouser Description: CAP CER 0.22UF 50V X7R 0805; Category: Cap; Ipc Land Pattern Name: CAPC200125X78; Temperature Range High: +125°C; Package: C0805C-DN; Device Class L2: Capacitors; Voltage Rating: 50 V
D1 D2 D5-D11 D17-D25 D27-D30 = Diode_Fairchild-ON_Semiconductor_LL4148_eec: DIODE GEN PURP 100V 200MA SOD80; Part Number: LL4148; Manufacturer: Fairchild/ON Semiconductor; Num Pins: 2; helpURL: https://upverter.com/upn/revision/7267ed481d20a817/; ComponentLink2Description: Datasheet; Temperature: -55°C to +175°C; Package: SOD80; Supplier 2: Mouser; Price: 0.0408687939508; Supplier 1: Digi-Key; ComponentLink1URL: https://upverter.com/upn/revision/7267ed481d20a817/; Supplier Part Number 2: 512-LL4148; Supplier Part Number 1: LL4148FSCT-ND; ComponentLink1Description: Upverter; ComponentLink2URL: https://www.fairchildsemi.com/datasheets/LL/LL4148.pdf; RoHS: TRUE; Mouser Part Number: 512-LL4148; Temperature Range High: +175°C; Digikey Description: DIODE GEN PURP 100V 200MA SOD80; Digikey Part Number: LL4148FSCT-ND; Lead Free: yes; Temperature Range Low: -55°C
D12 = CMP-12791-000009-1: DIODE GEN PURP 400V 1A SMA; Manufacturer: Diodes Inc.; Max Surge Forward Current: 30A; Peak Reverse Current: 5uA; Standoff Height: 0.05mm; Value: 20pF; Max Junction Temp: +150°C; Digikey Description: DIODE GEN PURP 400V 1A SMA; ComponentLink2URL: https://www.diodes.com/assets/Datasheets/ds16008.pdf; Device Class L1: Discrete Semiconductors; Mouser Description: Rectifiers 400V 1A; Manufacturer Part Number: US1G-13-F; Package: SMA; Height: 2.4mm; Automotive: No; Temperature Range High: +150°C; RoHS: TRUE; Lead Free: Yes; Temperature: -65°C to +150°C; Category: Diode; Octopart: https://octopart.com/us1g-13-f-diodes+inc.-334651; Temperature Range Low: -65°C; Forward Current: 1A; Footprint Url: https://www.diodes.com/assets/Package-Files/SMA.pdf; ComponentLink2Description: Datasheet; Reverse Voltage: 400V; Capacitance: 20pF; Device Class L3: Rectifier Diodes; Max Repetitive Reverse Voltage: 400V; Device Class L2: Diodes
D13 D16 = CMP-02540-000074-1: DIODE GEN PURP 1KV 1A DO214BA; Forward Voltage: 1.2V; Reverse Recovery Time-Max: 2s; Recovery Time: 3000ns; Peak Non-Repetitive Surge Current: 30A; Max Reverse Current: 5uA; Reverse Recovery Time: 2us; Element Configuration: Single; Length: 4.75mm; Height: 2.74mm; Case/Package: DO-214BA; Average Rectified Current: 1A; Packaging: Tape and Reel; Forward Current: 1A; Width: 2.9mm; Package Quantity: 1; Max Repetitive Reverse Voltage (Vrrm): 1kV; Mount: Surface Mount; Radiation Hardening: No; Max Forward Surge Current (Ifsm): 30A; Max Surge Current: 30A; Reverse Voltage: 1kV; Max Operating Temperature: 175°C; RoHS Compliant: Yes; Series: SUPERECTIFIER®; Number of Pins: 2; Min Operating Temperature: -65°C; Lead Free: Lead Free; Max Reverse Voltage (DC): 1kV
D14 D15 = CMP-249167-000001-1: DIODE GEN PURP 75V 150MA SOD80; Manufacturer: Vishay Small Signal; Max Junction Temp: +175°C; Automotive Grade: Grade 0; Capacitance: 4pF; Peak Reverse Current: 5uA; Forward Current: 300mA; Max Repetitive Reverse Voltage: 100V; Max Surge Forward Current: 2A; Value: 4pF; ComponentLink2Description: Datasheet; Height: 1.6mm; ComponentLink2URL: http://www.vishay.com/docs/85557/ll4148.pdf; Category: Diode; Lead Free: Yes; Device Class L3: Rectifier Diodes; Reverse Voltage: 75V; Mouser Description: Diodes - General Purpose, Power, Switching 100 Volt 100mA; RoHS: TRUE; Temperature: to +175°C; Automotive: Yes; Octopart: https://octopart.com/ll4448-gs08-vishay+small+signal-40886; Digikey Description: DIODE GEN PURP 75V 150MA SOD80; Manufacturer Part Number: LL4448-GS08; Temperature Range High: +175°C; Device Class L1: Discrete Semiconductors; Device Class L2: Diodes; Package: 6.560-5005.01-4
D26 = CMP-1060-01280-1: 5 W Zener Voltage Regulator, 2-Pin Surmetic(TM) 40, Pb-Free, Bulk Box; Manufacturer: On Semiconductor; P Max (W): 5; VZ Typ (V): 12; PartNumber: 1N5349BG; ComponentLink1URL: http://www.onsemi.com/; ComponentLink3URL: http://www.onsemi.cn/pub_link/Collateral/017AA.PDF; Mounting Technology: Through Hole; PackageDescription: 2-Pin, Axial Lead, Diameter 3.49 mm; ComponentLink1Description: Manufacturer URL; ComponentLink2URL: http://www.onsemi.cn/pub_link/Collateral/1N5333B-D.PDF; DatasheetVersion: Rev. 14; PackageVersion: Rev. O, 09/2005; ComponentLink3Description: Package Specification; RoHS: Pb-Free; PackageReference: SURMETIC40-2-017AA-01; Packing: Bulk Box; ComponentLink2Description: Datasheet
D? = CMP-02541-000026-1: DIODE ZENER 8.2V 500MW DO35; Test Current: 5mA; Tolerance: 2%; Impedance: 7R; ESD Protection: No; Element Configuration: Single; Max Reverse Leakage Current: 100nA; Packaging: Ammo Pack; Case/Package: DO-35; Lead Free: Lead Free; Number of Pins: 2; Min Operating Temperature: -65°C; Contact Plating: Tin; Max Power Dissipation: 500mW; Radiation Hardening: No; Max Operating Temperature: 175°C; Mount: Through Hole; Package Quantity: 30000; Voltage Tolerance: 2%; Series: Automotive, AEC-Q101; Zener Voltage: 8.2V; RoHS Compliant: Yes; Power Dissipation: 500mW
J1 J2 = 691101710002: WR-TBL Series 101 Horizontal Entry Modular, THT, pitch 5mm, 2p; Manufacturer: Wurth Elektronik; Modularity: Yes; Rated Current: 16A; Working Voltage: 250V; ComponentLink1Description: Website Link; ComponentLink1URL: https://www.we-online.com/redexpert/article/691101710002?ad; ComponentLink2Description: Datasheet Link; ComponentLink2URL: https://www.we-online.com/redexpert/spec/691101710002?ad; Manufacturer Part Number: 691101710002; Category: Terminal Blocks; Match Code: WR-TBL; Mount: Through Hole; Operating Temperature Max: 105°C; Operating Temperature Min: -40°C; Packaging: Box; Application: Pressure Clamp; Number of Pins: 2; Number of Rows: 1; Orientation: Horizontal; Pitch: 5mm
Q11 = CMP-65434-000005-1: OPTOISOLATOR 5KV TRANS 4SMD; Reverse Breakdown Voltage: 6V; Output Current per Channel: 30mA; Power Dissipation: 200mW; Collector-emitter Voltage-Max: 200mV; Max Output Voltage: 80V; Input Current: 50mA; Forward Voltage: 1.4V; Fall Time: 18000ns; Number of Elements: 1; Input Type: DC; Packaging: Tape and Reel; RoHS Compliant: Yes; Contact Plating: Copper; Min Operating Temperature: -30°C; Collector Emitter Saturation Voltage: 200mV; Max Input Current: 50mA; Radiation Hardening: No; Max Collector Current: 50mA; Case/Package: SMD/SMT; Mount: Surface Mount; Output Voltage: 80V; Forward Current: 50mA; Max Power Dissipation: 200mW; Collector Emitter Voltage (VCEO): 80V; Number of Channels: 1; Rise Time: 18000ns; Isolation Voltage: 5kV; Number of Pins: 4; Lead Free: Lead Free; Package Quantity: 2000; Isolation Voltage-Max: 5kV; Max Operating Temperature: 100°C
R44 R46-R48 R50-R53 R55 R56 R58 R59 R61-R65 R108 R113-R116 R?#1-R?#3 R?#7 = CRCW08050000Z0EA
  R44 R46-R48 R50-R53 R55 R56 R58 R59 R61-R65 R108 R113 R114 R116 R?#1-R?#3 R?#7: 100k: *
R109 = CMP-03412-028725-1: RES SMD 10 OHM 1% 1/8W 0805; Manufacturer: Yageo; Tolerance: 0.0001; Value: 10Ω; Temperature Coefficient: 50 ppm/°C; Voltage Rating: 150V; Power Rating: 0.125W; Package: RT0805; Lead Free: Yes; Manufacturer Part Number: RT0805FRE0710RL; Series: RT; Footprint Url: http://www.yageo.com/exep/pages/download/literatures/PYu-R_Mount_10.pdf; Temperature Range High: +155°C; Temperature Range Low: -55°C; Octopart: https://octopart.com/rt0805fre0710rl-yageo-39855890; Height: 0.6mm; Device Class L1: Passive Components; Mouser Description: High Precision-High Stability Chip Resistor Thin Film 0805 10Ohm 1% Paper T/R; ComponentLink2URL: http://www.yageo.com/documents/recent/PYu-RT_1-to-0.01_RoHS_L_9.pdf; Device Class L2: Resistors; Composition: Thin Film; Device Class L3: Chip SMD Resistors; Automotive: No; RoHS: TRUE; Ipc Land Pattern Name: RESC200125X50; Temperature: -55°C to +155°C; ComponentLink2Description: Datasheet; Resistance: 10Ω; Category: Res; Digikey Description: RES SMD 10 OHM 1% 1/8W 0805
R110 = CMP-03412-028725-1: RES SMD 10 OHM 1% 1/8W 0805; Manufacturer Part Number: RT0805FRE0710RL; Manufacturer: Yageo; Tolerance: 0.0001; Value: 10Ω; Temperature Coefficient: 50 ppm/°C; Voltage Rating: 150V; Power Rating: 0.125W; Package: RT0805; Lead Free: Yes; Series: RT; Footprint Url: http://www.yageo.com/exep/pages/download/literatures/PYu-R_Mount_10.pdf; Temperature Range High: +155°C; Temperature Range Low: -55°C; Octopart: https://octopart.com/rt0805fre0710rl-yageo-39855890; Height: 0.6mm; Device Class L1: Passive Components; Mouser Description: High Precision-High Stability Chip Resistor Thin Film 0805 10Ohm 1% Paper T/R; ComponentLink2URL: http://www.yageo.com/documents/recent/PYu-RT_1-to-0.01_RoHS_L_9.pdf; Device Class L2: Resistors; Composition: Thin Film; Device Class L3: Chip SMD Resistors; Automotive: No; RoHS: TRUE; Ipc Land Pattern Name: RESC200125X50; Temperature: -55°C to +155°C; ComponentLink2Description: Datasheet; Resistance: 10Ω; Category: Res; Digikey Description: RES SMD 10 OHM 1% 1/8W 0805
R111 R112 = CMP-2001-04908-2: RES Thick Film, 10kΩ, 1%, 0.125W, 100ppm/°C, 0805; Resistance: 10kR; Voltage Rating (DC): 150V; Power Rating: 125mW; Weight: 0.000194oz; Package Quantity: 5000; Military Standard: Not; Max Operating Temperature: 155°C; Temperature Coefficient: 100ppm/°C; Contact Plating: Tin; Width: 1.25mm; Height: 0.45mm; Radiation Hardening: No; Tolerance: 1%; Min Operating Temperature: -55°C; Voltage Rating: 150V; Length: 2mm; Depth: 1.25mm; Termination: SMD/SMT; Packaging: Tape and Reel; Case/Package: 0805; Case Code (Metric): 2012; Lead Free: Lead Free; Case Code (Imperial): 0805; Composition: Thick Film
R117 R118 = CMP-2001-04908-2: RES Thick Film, 1MΩ, 1%, 0.125W, 100ppm/°C, 0805; Resistance: 10kR; Voltage Rating (DC): 150V; Power Rating: 125mW; Weight: 0.000194oz; Package Quantity: 5000; Military Standard: Not; Max Operating Temperature: 155°C; Temperature Coefficient: 100ppm/°C; Contact Plating: Tin; Width: 1.25mm; Height: 0.45mm; Radiation Hardening: No; Tolerance: 1%; Min Operating Temperature: -55°C; Voltage Rating: 150V; Length: 2mm; Depth: 1.25mm; Termination: SMD/SMT; Packaging: Tape and Reel; Case/Package: 0805; Case Code (Metric): 2012; Lead Free: Lead Free; Case Code (Imperial): 0805; Composition: Thick Film
R119-R121 = CMP-03413-000003-1: RES 1.2 OHM 5W 5% AXIAL; Manufacturer Part Number: SQP500JB-1R2; Manufacturer: Yageo; Temperature Coefficient: 300ppm/°C; Resistance: 1.2Ω; Value: 1.2Ω; Voltage Rating: 350V; Lead Free: Yes; Package: SQP500; Composition: Wirewound; Series: SQP; Temperature: -55°C to +155°C; Device Class L2: Resistors; Digikey Description: RES 1.2 OHM 5W 5% AXIAL; RoHS: TRUE; Device Class L3: Through-Hole Resistors; ComponentLink2Description: Datasheet; ComponentLink2URL: https://datasheet.ciiva.com/2723/yageolr-sqpnsp-2013-2723111.pdf; Temperature Range High: +155°C; Octopart: https://octopart.com/sqp500jb-1r2-yageo-1162571; Device Class L1: Passive Components; Tolerance: 5%; Height: 10mm; Category: Res; Ipc Land Pattern Name: RESAD2911W100L2350D1050; Automotive: No; Power Rating: 5W; Temperature Range Low: -55°C
R125-R127 R129 R133 R134 R136 R137 = CMP-2001-04908-2: RES Thick Film, 2kΩ, 1%, 0.125W, 100ppm/°C, 0805; Resistance: 10kR; Voltage Rating (DC): 150V; Power Rating: 125mW; Weight: 0.000194oz; Package Quantity: 5000; Military Standard: Not; Max Operating Temperature: 155°C; Temperature Coefficient: 100ppm/°C; Contact Plating: Tin; Width: 1.25mm; Height: 0.45mm; Radiation Hardening: No; Tolerance: 1%; Min Operating Temperature: -55°C; Voltage Rating: 150V; Length: 2mm; Depth: 1.25mm; Termination: SMD/SMT; Packaging: Tape and Reel; Case/Package: 0805; Case Code (Metric): 2012; Lead Free: Lead Free; Case Code (Imperial): 0805; Composition: Thick Film
R131 = CMP-2001-04908-2: RES Thick Film, 5kΩ, 1%, 0.125W, 100ppm/°C, 0805; Resistance: 10kR; Voltage Rating (DC): 150V; Power Rating: 125mW; Weight: 0.000194oz; Package Quantity: 5000; Military Standard: Not; Max Operating Temperature: 155°C; Temperature Coefficient: 100ppm/°C; Contact Plating: Tin; Width: 1.25mm; Height: 0.45mm; Radiation Hardening: No; Tolerance: 1%; Min Operating Temperature: -55°C; Voltage Rating: 150V; Length: 2mm; Depth: 1.25mm; Termination: SMD/SMT; Packaging: Tape and Reel; Case/Package: 0805; Case Code (Metric): 2012; Lead Free: Lead Free; Case Code (Imperial): 0805; Composition: Thick Film
R132 = CMP-2001-04908-2: RES Thick Film, 15kΩ, 1%, 0.125W, 100ppm/°C, 0805; Resistance: 10kR; Voltage Rating (DC): 150V; Power Rating: 125mW; Weight: 0.000194oz; Package Quantity: 5000; Military Standard: Not; Max Operating Temperature: 155°C; Temperature Coefficient: 100ppm/°C; Contact Plating: Tin; Width: 1.25mm; Height: 0.45mm; Radiation Hardening: No; Tolerance: 1%; Min Operating Temperature: -55°C; Voltage Rating: 150V; Length: 2mm; Depth: 1.25mm; Termination: SMD/SMT; Packaging: Tape and Reel; Case/Package: 0805; Case Code (Metric): 2012; Lead Free: Lead Free; Case Code (Imperial): 0805; Composition: Thick Film
R135 = CMP-2001-04908-2: RES Thick Film, 82kΩ, 1%, 0.125W, 100ppm/°C, 0805; Resistance: 10kR; Voltage Rating (DC): 150V; Power Rating: 125mW; Weight: 0.000194oz; Package Quantity: 5000; Military Standard: Not; Max Operating Temperature: 155°C; Temperature Coefficient: 100ppm/°C; Contact Plating: Tin; Width: 1.25mm; Height: 0.45mm; Radiation Hardening: No; Tolerance: 1%; Min Operating Temperature: -55°C; Voltage Rating: 150V; Length: 2mm; Depth: 1.25mm; Termination: SMD/SMT; Packaging: Tape and Reel; Case/Package: 0805; Case Code (Metric): 2012; Lead Free: Lead Free; Case Code (Imperial): 0805; Composition: Thick Film
R?#5 = CRCW08050000Z0EA: 22M; 100k: *
R?#6 R?#8 = RC0805FR-07100KL
RG1 = Reg_Fairchild_LM7805CT_eec: REG IC REG LINEAR 5V 1A TO220AB; Voltage Dropout (Max): 2V @ 1A (Typ); Voltage - Input (Max): 35V; helpURL: https://upverter.com/upn/revision/b27a7358b7dd93a3/; ComponentLink2Description: Datasheet; Temperature: -40°C to +125°C; Package: TO220; Supplier 2: Mouser; Price: 0.384521982769; Supplier 1: Digi-Key; ComponentLink1URL: https://upverter.com/upn/revision/b27a7358b7dd93a3/; Supplier Part Number 2: 512-LM7805CT; Supplier Part Number 1: LM7805CT-ND; Manufacturer: Fairchild; ComponentLink1Description: Upverter; ComponentLink2URL: https://www.fairchildsemi.com/datasheets/LM/LM7805.pdf; RoHS: TRUE; Mouser Part Number: 512-LM7805CT; Ipc Land Pattern Name: TO-220; Temperature Range High: +125°C; Digikey Description: REG IC REG LINEAR 5V 1A TO220AB; Digikey Part Number: LM7805CT-ND; Lead Free: yes; Temperature Range Low: -40°C; Voltage - Output: 5V; Current-Output: 1A
T3 = Transformer 48x410V
TP1-TP5 TP9-TP13 TP15-TP20 TP23 TP28-TP32 TP?#1 TP?#2 = TP_PCB?: Test_Point
U15 = CMP-32851-000156-1: MOSFET DRVR 600V 0.36A 2-OUT Hi/Lo Side Non-Inv 8-Pin SOIC
U16 = CMP-0062-01639-4: 800mA Low-Dropout Linear Regulator, 4-pin SOT-223, Pb-Free; Manufacturer: Texas Instruments; High-Reliability: Y; PowerWise: N; PackageTopMarking: XYTT*N05A; CompType: LDO IC; ComponentLink1URL: http://www.ti.com/general/docs/lit/getliterature.tsp?genericPartNumber=LM1117-N&fileType=pdf; PartNumber: LM1117MPX-3.3/NOPB; ComponentLink1Description: Datasheet URL; PinCount: 4; Code_JEDEC: TO-261-AA; PackageDescription: Molded SOT-223, 6.50 x 3.56 x 1.6mm Body, 4 Lead, 2.3mm Pitch; PackageReference: DCY0004A; RoHS: Y; Code_IPC: SOT223-4
U18 = CMP-1310-00291-2: IC OPAMP GP 2 CIRCUIT 8SOIC; Gain Bandwidth Product: 1MHz; Number of Circuits: 2; Min Supply Voltage: 3V; Slew Rate: 0.6V/µs; Max Dual Supply Voltage: 16V; Common Mode Rejection Ratio: 65dB; Input Bias Current: 250nA; Min Dual Supply Voltage: 1.5V; Dual Supply Voltage: 9V; Operating Supply Current: 1.5mA; Output Current: 40mA; Input Offset Voltage (Vos): 7mV; Nominal Supply Current: 1.2mA; Voltage Gain: 100dB; Max Supply Voltage: 32V; Width: 4mm; Number of Pins: 8; Min Operating Temperature: 0°C; REACH SVHC: No SVHC; Contact Plating: Tin; Lead Free: Lead Free; Halogen Free: Halogen Free; Power Supply Rejection Ratio (PSRR): 65dB; Operating Supply Voltage: 16V; Package Quantity: 2500; Max Operating Temperature: 70°C; Case/Package: SOIC; Height: 1.5mm; Packaging: Tape and Reel; Radiation Hardening: No; Number of Channels: 2; Bandwidth: 1MHz; Length: 5mm; Number of Elements: 2; Number of Amplifiers: 2; Output Current per Channel: 40mA
U19 = CMP-07128-000015-1: IC REG LINEAR 12V 1A TO220-3; Obsolete Part: true; Manufacturer: ON Semiconductor; Nominal Supply Current: 5.1mA; Output Type: Fixed; Dropout Voltage: 2V; Max Supply Voltage: 35V; Accuracy Percentage: 4%; Standoff Height: 2.7mm; Number Of Outputs: 1; Octopart: https://octopart.com/lm7812ct-on+semiconductor-14383031; Output Current: 1A; ComponentLink2Description: Datasheet; Device Class L1: Integrated Circuits (ICs); Device Class L2: Power Management ICs; Temperature Range Low: -40°C; Category: IC; Package: TO220B03; Device Class L3: Voltage Regulators - Linear; RoHS: TRUE; Digikey Description: IC REG LINEAR 12V 1A TO220-3; Ipc Land Pattern Name: TO-220; Output Voltage: 12V; Temperature: -40°C to +125°C; Automotive: No; Temperature Range High: +125°C; ComponentLink2URL: https://www.mouser.in/datasheet/2/308/LM7812-1125088.pdf; Manufacturer Part Number: LM7812CT; Height: 20.4mm; Lead Free: Yes
U21 = CMP-0319-00950-2: Pulse-Width-Modulation Control Circuit with Voltage Control, 45 % Duty Cycle, 0 to +70 degC, 16-pin SOIC (D), Green (RoHS & no Sb/Br); Manufacturer: Texas Instruments; Regulated Outputs(#): 2; Frequency(Max)(kHz): 300; Topology: Boost, Buck, Flyback, Forward, Full-Bridge, Half-Bridge, Push-Pull; SubFamily: PWM Controller; Duty Cycle(Max)(%): 45; Rating: Military; PackageDescription: 16-Pin Plastic Small Outline Integrated Circuit, 9.9 x 3.9 mm, Pitch 1.27 mm Pitch; Mounting Technology: Surface Mount; PackageReference: D0016A; DatasheetVersion: SLVS074E; Control Method: Voltage; ComponentLink1Description: Datasheet; ComponentLink1URL: http://www.ti.com/general/docs/lit/getliterature.tsp?genericPartNumber=TL494&fileType=pdf; Code_JEDEC: MS-012AC; Eco-Plan: Green (RoHS & no Sb/Br); PackageVersion: revM, Jun-2011; PartNumber: TL494CDR
U?#1 U?#2 = CMP-0572-00019-2: ARM Cortex-M4 32-bit MCU, 256 KB Flash, 40 KB Internal RAM, 37 I/Os, 48-pin LQFP, -40 to 85 degC, Tray; Supply Voltage(Vcc) min (V): 2; Internal RAM Size (kB): 40; D/A Converter: 2x12-bit (2 Channel); FLASH Size (Prog) (kB): 256; I/Os (High Current): 37; Operating Frequency(F) (Processor speed) (MHz): 72; ComponentLink1URL: http://www.st.com/web/en/home.html; Packing: Tray; ComponentLink3Description: Package Specification; ComponentLink2URL: http://www.st.com/st-web-ui/static/active/en/resource/technical/document/datasheet/DM00058181.pdf; Mounting Technology: Surface Mount; PackageReference: LQFP48; DatasheetVersion: Rev. 6; ComponentLink2Description: Datasheet; ComponentLink3URL: http://www.st.com/st-web-ui/static/active/en/resource/technical/document/datasheet/DM00058181.pdf; PackageDescription: 48-Pin Low Profile Quad Flat Package, 7 x 7 mm Body, 0.5 mm Pitch; ComponentLink1Description: Manufacturer URL; Core: ARM Cortex-M4; PackageVersion: Rev. 6, 06/2013; PartNumber: STM32F303CCT6
VT30 VT31 = IRF3205: Транзистор МОП, одиночный, N-канальный; ComponentDescription: =ComponentType+', '+ChannelType+', '+Comment+', '+Package; ChannelType: N-канальный; ComponentType: Транзистор МОП, одиночный; Package: TO-220(bend2)